# EAGLE design buffered-mult (EAGLE 7.6.0)
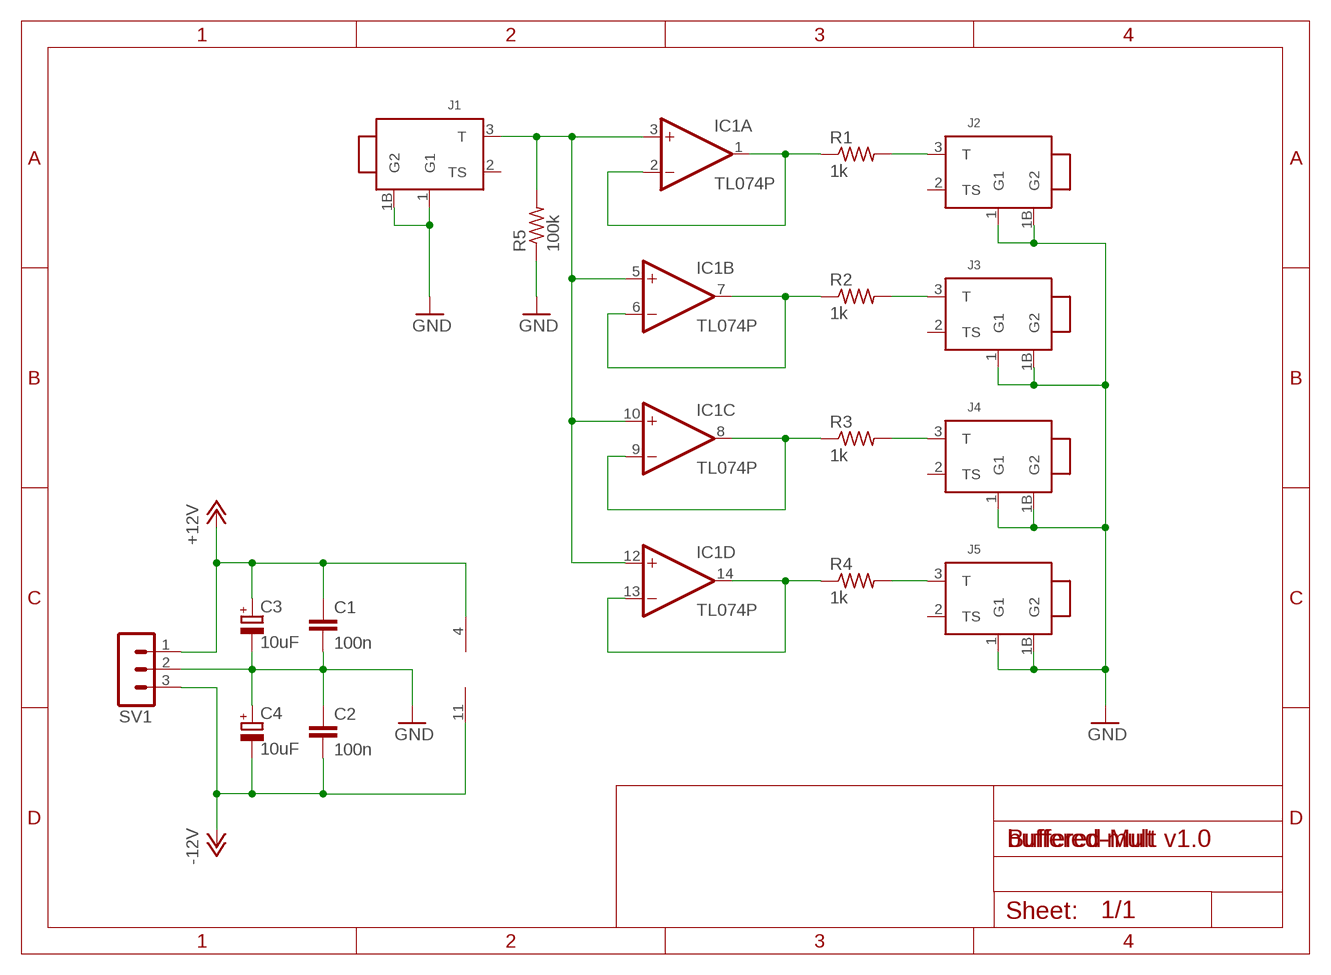
[diagram p0: schematic, sheet 1]

## Parts
C1  100n  C-EU025-025X050  [C025-025X050]
C2  100n  C-EU025-025X050  [C025-025X050]
C3  10uF  CPOL-EUE2,5-6E  [E2,5-6E]
C4  10uF  CPOL-EUE2,5-6E  [E2,5-6E]
IC1  TL074P  [DIL14]
J1  THONK_JACK  [THONK_JACK_P]
J2  THONK_JACK  [THONK_JACK_P]
J3  THONK_JACK  [THONK_JACK_P]
J4  THONK_JACK  [THONK_JACK_P]
J5  THONK_JACK  [THONK_JACK_P]
R1  1k  R-US_0207/10  [0207/10]
R2  1k  R-US_0207/10  [0207/10]
R3  1k  R-US_0207/10  [0207/10]
R4  1k  R-US_0207/10  [0207/10]
R5  100k  R-US_0207/10  [0207/10]
SV1  MA03-1  [MA03-1]

## Nets
+12V: C1.1 C3.+ IC1.4(P:V+) SV1.1
-12V: C2.2 C4.- IC1.11(P:V-) SV1.3
GND: C1.2 C2.1 C3.- C4.+ J1.1(G1) J1.1B(G2) J2.1(G1) J2.1B(G2) J3.1(G1) J3.1B(G2) J4.1(G1) J4.1B(G2) J5.1(G1) J5.1B(G2) R5.1 SV1.2
N$1: IC1.1(A:OUT) IC1.2(A:-IN) R1.1
N$2: IC1.6(B:-IN) IC1.7(B:OUT) R2.1
N$3: IC1.8(C:OUT) IC1.9(C:-IN) R3.1
N$4: IC1.13(D:-IN) IC1.14(D:OUT) R4.1
N$7: J2.3(T) R1.2
N$8: J3.3(T) R2.2
N$9: IC1.3(A:+IN) IC1.5(B:+IN) IC1.10(C:+IN) IC1.12(D:+IN) J1.3(T) R5.2
N$10: J4.3(T) R3.2
N$11: J5.3(T) R4.2
Unconnected: J1.2(TS) J2.2(TS) J3.2(TS) J4.2(TS) J5.2(TS)

## Notes on the sheet
- Buffered-Mult v1.0

## Library data of the parts
C1 C2 = resistor:C-EU: CAPACITOR, European symbol
C3 C4 = resistor:CPOL-EU: POLARIZED CAPACITOR, European symbol
IC1 = linear:TL074: OP AMP
J1-J5 = crows_thonk_pj301bm:THONK_JACK
R1-R5 = resistor:R-US_: RESISTOR, American symbol
SV1 = con-lstb:MA03-1: PIN HEADER; OC_FARNELL: unknown; OC_NEWARK: unknown

## Board
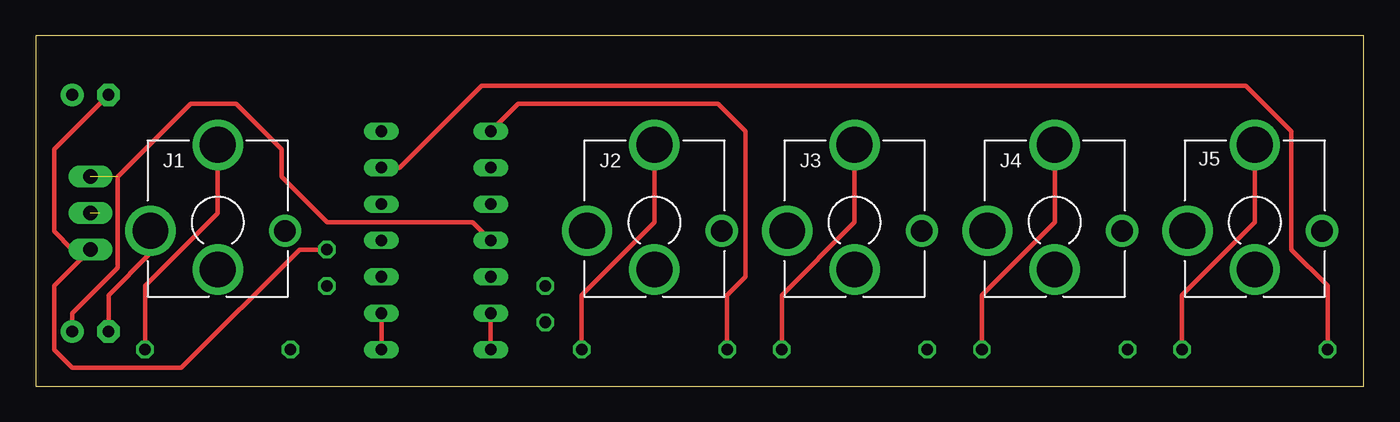
[diagram p1: board, top side]
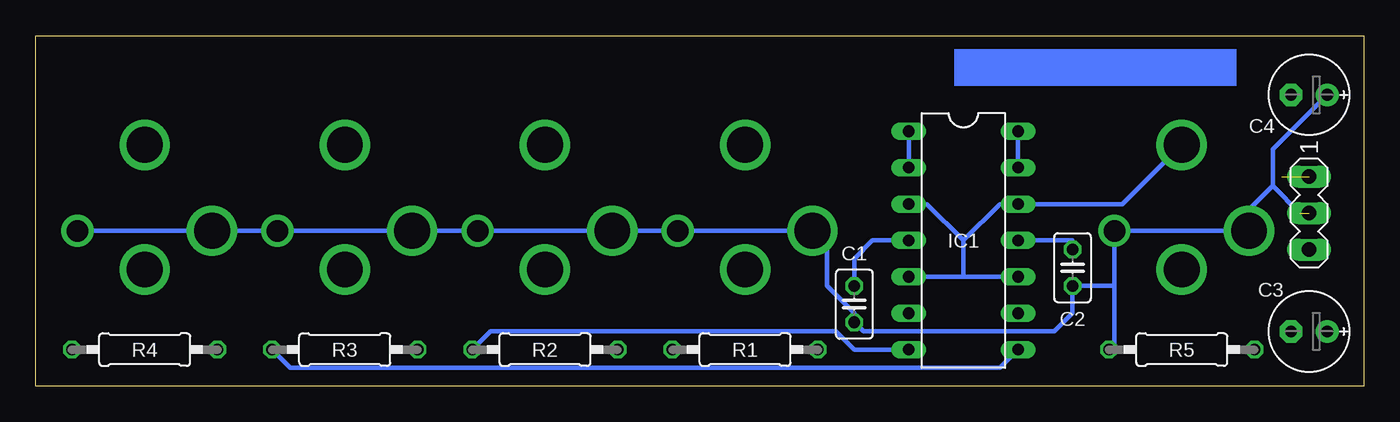
[diagram p2: board, bottom side, seen from below]

Size 92.69 x 24.43 mm. Coordinates in mm from the lower left corner, seen from the top.
Outline: 0,0 92.69,0 92.69,24.43 0,24.43 0,0
Copper layers (1*16): Top 0.035559375mm / dielectric 1.6mm / Bottom 0.035559375mm
Design rules "jlcpcb2layer": minimum track width 5mil, minimum drill 12mil, track to track 5mil, track to pad 5mil, pad to pad 5mil, via to via 5mil, smd to smd 5mil, copper to edge 8mil, drill to drill 6mil, minimum pad ring 5mil, minimum via ring 3mil, stop-mask expansion 2.5mil, vias tented up to drill 0mil, thermal gap 10mil

### Footprints (pad centres in the part's own frame; a part is rotated, then mirrored left to right if it is on the bottom)
C025-025X050 = drill 0.813 octagon: 1 -1.27,0; 2 1.27,0
E2,5-6E = drill 0.813 pad 1.575: + -1.27,0 | drill 0.813 pad 1.575 octagon: - 1.27,0
DIL14 = drill 0.813 long: 1 -7.62,-3.81; 2 -5.08,-3.81; 3 -2.54,-3.81; 4 0,-3.81; 5 2.54,-3.81; 6 5.08,-3.81; 7 7.62,-3.81; 8 7.62,3.81; 9 5.08,3.81; 10 2.54,3.81; 11 0,3.81; 12 -2.54,3.81; 13 -5.08,3.81; 14 -7.62,3.81
THONK_JACK_P = drill 2.5: 1 -4.7,-0.6; 2 0,-3.3; 3 0,5.4 | drill 1.5: 1B 4.7,-0.6
0207/10 = drill 0.813 octagon: 1 -5.08,0; 2 5.08,0
MA03-1 = drill 1.016 long: 1 -2.54,0; 2 0,0; 3 2.54,0

### Placement (x,y rotation side)
C1  35.56,5.71 270 bottom
C2  20.32,8.26 90 bottom
C3  3.81,3.81 180 bottom
C4  3.81,20.32 180 bottom
IC1  27.94,10.16 270 bottom
J1  12.7,11.43 0 top
J2  43.18,11.43 0 top
J3  57.15,11.43 0 top
J4  71.12,11.43 0 top
J5  85.09,11.43 0 top
R1  43.18,2.54 0 bottom
R2  57.15,2.54 0 bottom
R3  71.12,2.54 0 bottom
R4  85.09,2.54 0 bottom
R5  12.7,2.54 0 bottom
SV1  3.81,12.06 270 bottom

### Tracks (layer width: path | path; a pad name or v marks a point on that pad's centre or on a via)
+12V  (1 unrouted)
  Top 0.305: C3.+ 2.54,5.08 5.71,8.26 5.71,14.61 10.79,19.68 13.97,19.68 17.14,16.51 17.14,14.61 20.32,11.43 30.48,11.43 IC1.4
  Bottom 0.305: IC1.4 34.29,10.16 35.56,8.89 C1.1
-12V
  Top 0.305: C4.- 1.27,16.51 1.27,10.79 2.54,9.53 SV1.3 1.27,6.99 1.27,2.54 2.54,1.27 10.16,1.27 18.41,9.53 C2.2
  Bottom 0.305: C2.2 20.32,10.16 IC1.11
GND  (1 unrouted)
  Top 0.305: J1.1 8,9.27 5.08,6.35 C3.-
  Bottom 0.305: J5.1B J5.1 J4.1B J4.1 J3.1B J3.1 J2.1B J2.1 37.47,10.83 37.47,6.99 35.56,5.08 C1.2 34.92,3.81 21.59,3.81 20.32,5.08 C2.1 17.4,6.99 | 17.4,6.99 J1.1B J1.1 8,12.32 6.35,13.97 | 4.45,12.06 6.35,13.97 | 6.35,13.97 6.35,16.51 C4.+ | 17.4,6.99 17.4,2.92 R5.1
N$1
  Top 0.305: R1.1 48.26,6.35 49.53,7.62 49.53,17.78 47.62,19.68 33.66,19.68 IC1.1
  Bottom 0.305: IC1.1 IC1.2
N$2
  Top 0.305: IC1.6 IC1.7
  Bottom 0.305: IC1.7 35.56,2.54 36.83,3.81 60.96,3.81 R2.1
N$3
  Top 0.305: IC1.9 IC1.8
  Bottom 0.305: IC1.8 25.4,1.27 74.93,1.27 R3.1
N$4
  Top 0.305: IC1.13 25.4,15.24 26.67,16.51 31.11,20.95 84.45,20.95 87.63,17.78 87.63,9.53 90.17,6.99 R4.1
  Bottom 0.305: IC1.14 IC1.13
N$7
  Top 0.305: J2.3 43.18,11.43 38.1,6.35 R1.2
N$8
  Top 0.305: J3.3 57.15,11.43 52.07,6.35 R2.2
N$9
  Top 0.305: R5.2 7.62,6.99 12.7,12.06 J1.3
  Bottom 0.305: IC1.10 27.94,7.62 | 27.94,7.62 IC1.5 | J1.3 16.83,12.7 IC1.12 25.4,12.7 27.94,10.16 | 27.94,10.16 27.94,7.62 | IC1.3 30.48,12.7 27.94,10.16
N$10
  Top 0.305: R3.2 66.04,6.35 71.12,11.43 J4.3
N$11
  Top 0.305: J5.3 85.09,11.43 80.01,6.35 R4.2
(copper drawn outside any net)
  shapes: Bottom area x1

### Text on the board
bStop: Buffered-Mult v1.0